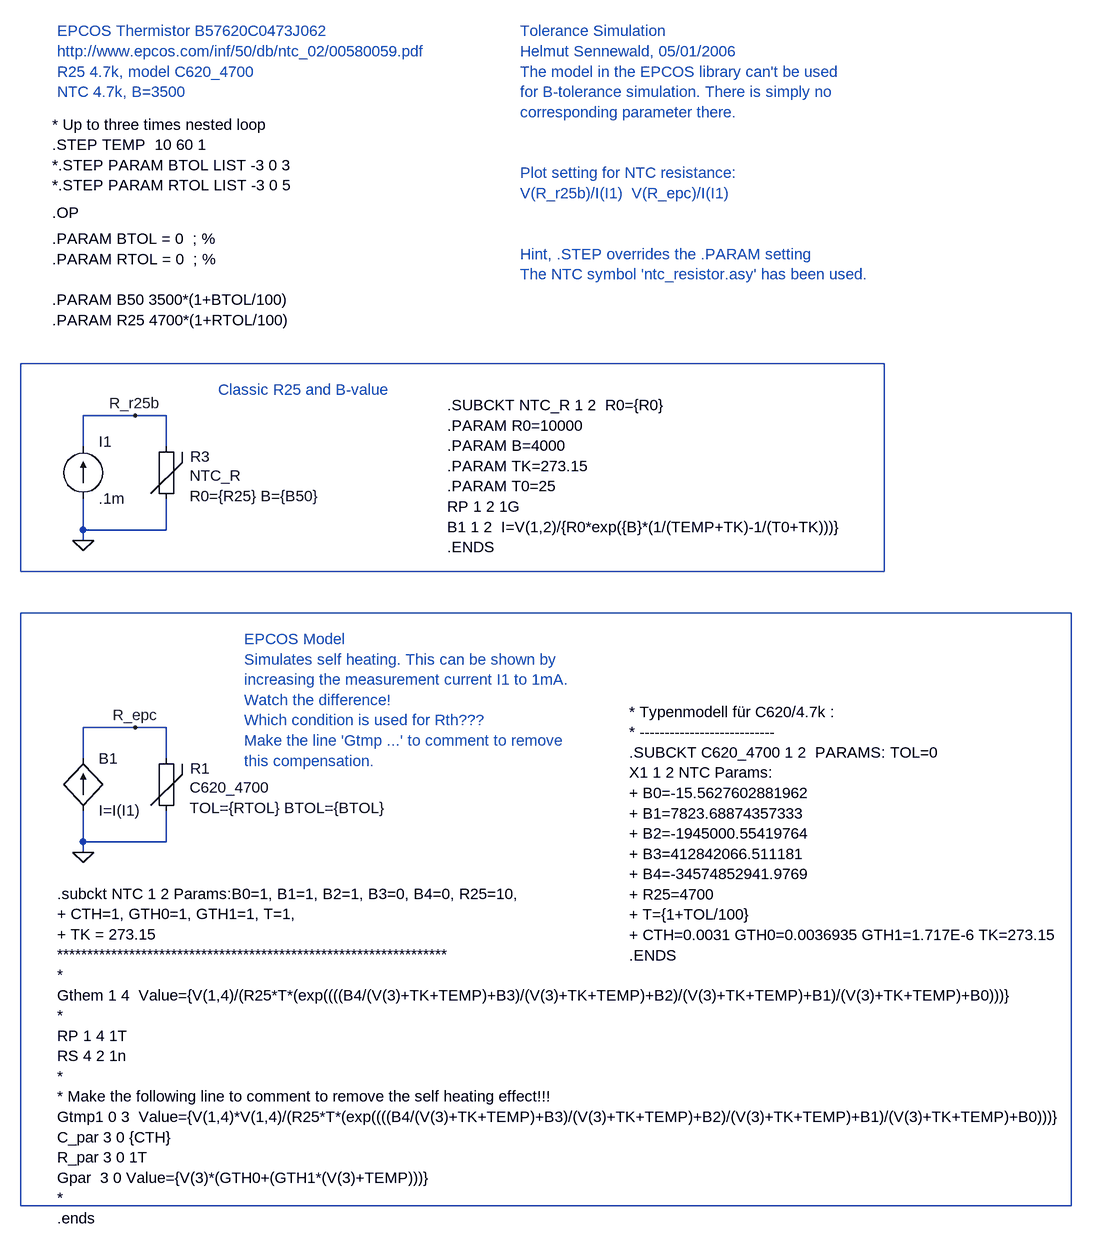
[diagram p0: schematic ntc4k7B3500_test.asc]
ntc4k7B3500_test.asc, the LTspice schematic file:
Version 4
SHEET 1 3212 2372
WIRE 944 1152 944 1104
WIRE 944 1280 944 1232
WIRE 944 1296 944 1280
WIRE 944 1632 944 1584
WIRE 944 1760 944 1712
WIRE 944 1776 944 1760
WIRE 1024 1104 944 1104
WIRE 1024 1584 944 1584
WIRE 1072 1104 1024 1104
WIRE 1072 1152 1072 1104
WIRE 1072 1280 944 1280
WIRE 1072 1280 1072 1232
WIRE 1072 1584 1024 1584
WIRE 1072 1632 1072 1584
WIRE 1072 1760 944 1760
WIRE 1072 1760 1072 1712
FLAG 944 1296 0
FLAG 1024 1104 R_r25b
FLAG 944 1776 0
FLAG 1024 1584 R_epc
SYMBOL current 944 1232 M180
WINDOW 0 24 88 Left 0
WINDOW 3 24 0 Left 0
WINDOW 123 0 0 Left 0
WINDOW 39 0 0 Left 0
SYMATTR InstName I1
SYMATTR Value .1m
SYMBOL ntc_resistor 1056 1136 R0
SYMATTR InstName R3
SYMATTR Value R0={R25} B={B50}
SYMBOL ntc_resistor 1056 1616 R0
SYMATTR InstName R1
SYMATTR SpiceModel C620_4700
SYMATTR Value TOL={RTOL} BTOL={BTOL}
SYMBOL bi2 944 1632 R0
SYMATTR InstName B1
SYMATTR Value I=I(I1)
TEXT 896 792 Left 0 !.OP
TEXT 896 656 Left 0 !* Up to three times nested loop\n.STEP TEMP  10 60 1\n*.STEP PARAM BTOL LIST -3 0 3\n*.STEP PARAM RTOL LIST -3 0 5
TEXT 1504 1088 Left 0 !.SUBCKT NTC_R 1 2  R0={R0} \n.PARAM R0=10000\n.PARAM B=4000\n.PARAM TK=273.15\n.PARAM T0=25\nRP 1 2 1G\nB1 1 2  I=V(1,2)/{R0*exp({B}*(1/(TEMP+TK)-1/(T0+TK)))}\n.ENDS
TEXT 1616 512 Left 0 ;Tolerance Simulation\nHelmut Sennewald, 05/01/2006\nThe model in the EPCOS library can't be used \nfor B-tolerance simulation. There is simply no \ncorresponding parameter there.\n \n \nPlot setting for NTC resistance:\nV(R_r25b)/I(I1)  V(R_epc)/I(I1) \n \n \nHint, .STEP overrides the .PARAM setting\nThe NTC symbol 'ntc_resistor.asy' has been used.
TEXT 896 832 Left 0 !.PARAM BTOL = 0  ; %\n.PARAM RTOL = 0  ; %\n \n.PARAM B50 3500*(1+BTOL/100)\n.PARAM R25 4700*(1+RTOL/100)
TEXT 904 1840 Left 0 !.subckt NTC 1 2 Params:B0=1, B1=1, B2=1, B3=0, B4=0, R25=10, \n+ CTH=1, GTH0=1, GTH1=1, T=1,\n+ TK = 273.15\n*****************************************************************\n*\nGthem 1 4  Value={V(1,4)/(R25*T*(exp((((B4/(V(3)+TK+TEMP)+B3)/(V(3)+TK+TEMP)+B2)/(V(3)+TK+TEMP)+B1)/(V(3)+TK+TEMP)+B0)))}\n*\nRP 1 4 1T\nRS 4 2 1n\n*\n* Make the following line to comment to remove the self heating effect!!!\nGtmp1 0 3  Value={V(1,4)*V(1,4)/(R25*T*(exp((((B4/(V(3)+TK+TEMP)+B3)/(V(3)+TK+TEMP)+B2)/(V(3)+TK+TEMP)+B1)/(V(3)+TK+TEMP)+B0)))}\nC_par 3 0 {CTH}\nR_par 3 0 1T\nGpar  3 0 Value={V(3)*(GTH0+(GTH1*(V(3)+TEMP)))}\n*\n.ends
TEXT 1784 1560 Left 0 !* Typenmodell für C620/4.7k :\n* ---------------------------\n.SUBCKT C620_4700 1 2  PARAMS: TOL=0    \nX1 1 2 NTC Params: \n+ B0=-15.5627602881962 \n+ B1=7823.68874357333\n+ B2=-1945000.55419764 \n+ B3=412842066.511181 \n+ B4=-34574852941.9769 \n+ R25=4700 \n+ T={1+TOL/100} \n+ CTH=0.0031 GTH0=0.0036935 GTH1=1.717E-6 TK=273.15\n.ENDS
TEXT 1192 1448 Left 0 ;EPCOS Model\nSimulates self heating. This can be shown by \nincreasing the measurement current I1 to 1mA. \nWatch the difference!  \nWhich condition is used for Rth???\nMake the line 'Gtmp ...' to comment to remove\nthis compensation.
TEXT 1152 1064 Left 0 ;Classic R25 and B-value
TEXT 904 512 Left 0 ;EPCOS Thermistor B57620C0473J062\nhttp://www.epcos.com/inf/50/db/ntc_02/00580059.pdf\nR25 4.7k, model C620_4700\nNTC 4.7k, B=3500
RECTANGLE Normal 2176 1344 848 1024
RECTANGLE Normal 2464 2320 848 1408

The netlist it stands for:
* ntc4k7B3500_test.asc
I1 0 R_r25b .1m
XR3 R_r25b 0 NTC_R R0={R25} B={B50}  ; pins A B
XR1 R_epc 0 C620_4700 TOL={RTOL} BTOL={BTOL}  ; pins A B
B1 0 R_epc I=I(I1)
.OP
* Up to three times nested loop
.STEP TEMP  10 60 1
*.STEP PARAM BTOL LIST -3 0 3
*.STEP PARAM RTOL LIST -3 0 5
.SUBCKT NTC_R 1 2  R0={R0}
.PARAM R0=10000
.PARAM B=4000
.PARAM TK=273.15
.PARAM T0=25
RP 1 2 1G
B1 1 2  I=V(1,2)/{R0*exp({B}*(1/(TEMP+TK)-1/(T0+TK)))}
.ENDS
* Tolerance Simulation
* Helmut Sennewald, 05/01/2006
* The model in the EPCOS library can't be used
* for B-tolerance simulation. There is simply no
* corresponding parameter there.
* Plot setting for NTC resistance:
* V(R_r25b)/I(I1)  V(R_epc)/I(I1)
* Hint, .STEP overrides the .PARAM setting
* The NTC symbol 'ntc_resistor.asy' has been used.
.PARAM BTOL = 0  ; %
.PARAM RTOL = 0  ; %
.PARAM B50 3500*(1+BTOL/100)
.PARAM R25 4700*(1+RTOL/100)
.subckt NTC 1 2 Params:B0=1, B1=1, B2=1, B3=0, B4=0, R25=10,
+ CTH=1, GTH0=1, GTH1=1, T=1,
+ TK = 273.15
*****************************************************************
*
Gthem 1 4  Value={V(1,4)/(R25*T*(exp((((B4/(V(3)+TK+TEMP)+B3)/(V(3)+TK+TEMP)+B2)/(V(3)+TK+TEMP)+B1)/(V(3)+TK+TEMP)+B0)))}
*
RP 1 4 1T
RS 4 2 1n
*
* Make the following line to comment to remove the self heating effect!!!
Gtmp1 0 3  Value={V(1,4)*V(1,4)/(R25*T*(exp((((B4/(V(3)+TK+TEMP)+B3)/(V(3)+TK+TEMP)+B2)/(V(3)+TK+TEMP)+B1)/(V(3)+TK+TEMP)+B0)))}
C_par 3 0 {CTH}
R_par 3 0 1T
Gpar  3 0 Value={V(3)*(GTH0+(GTH1*(V(3)+TEMP)))}
*
.ends
* Typenmodell für C620/4.7k :
* ---------------------------
.SUBCKT C620_4700 1 2  PARAMS: TOL=0
X1 1 2 NTC Params:
+ B0=-15.5627602881962
+ B1=7823.68874357333
+ B2=-1945000.55419764
+ B3=412842066.511181
+ B4=-34574852941.9769
+ R25=4700
+ T={1+TOL/100}
+ CTH=0.0031 GTH0=0.0036935 GTH1=1.717E-6 TK=273.15
.ENDS
* EPCOS Model
* Simulates self heating. This can be shown by
* increasing the measurement current I1 to 1mA.
* Watch the difference!
* Which condition is used for Rth???
* Make the line 'Gtmp ...' to comment to remove
* this compensation.
* Classic R25 and B-value
* EPCOS Thermistor B57620C0473J062
* http://www.epcos.com/inf/50/db/ntc_02/00580059.pdf
* R25 4.7k, model C620_4700
* NTC 4.7k, B=3500
.backanno
.end